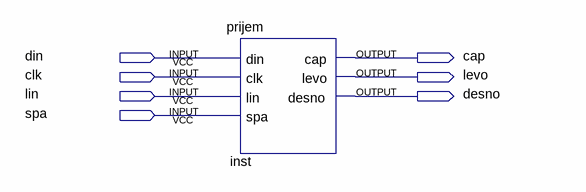
[diagram p0: schematic sheet]
// Quartus schematic test.bdf as structural Verilog: 1 symbols, 7 pins
module test (
  input  din,
  input  clk,
  input  lin,
  input  spa,
  output cap,
  output levo,
  output desno
);

  prijem inst (.din(din), .clk(clk), .lin(lin), .spa(spa), .cap(cap), .levo(levo), .desno(desno));
endmodule
